# Altium schematic sheet Power.SchDoc
size A
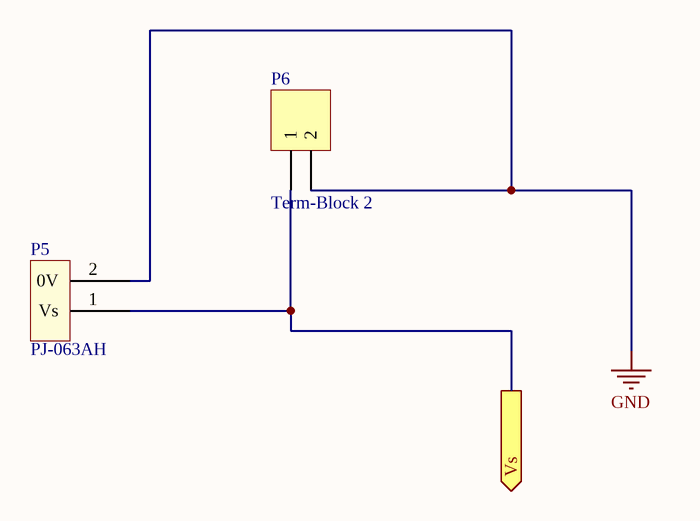
[diagram p0: Power.SchDoc]

## Parts
P5  PJ-063AH  [PJ-063AH]
P6  Term-Block 2  [TERM-BLOCK-5.08MM-2POS]

## Ports
Vs (out)

## Nets
GND: P5.2(0V) P6.2
Vs: P5.1(Vs) P6.1 ; port Vs

## Library data of the parts
P6 = C-Block2: Terminal-Block 1x2; LatestRevisionDate: 17-Jul-2002; LatestRevisionNote: Re-released for DXP Platform.; Publisher: Altium Limited